# Altium schematic sheet 04 PMIC2.SchDoc
size 420 x 297 mm
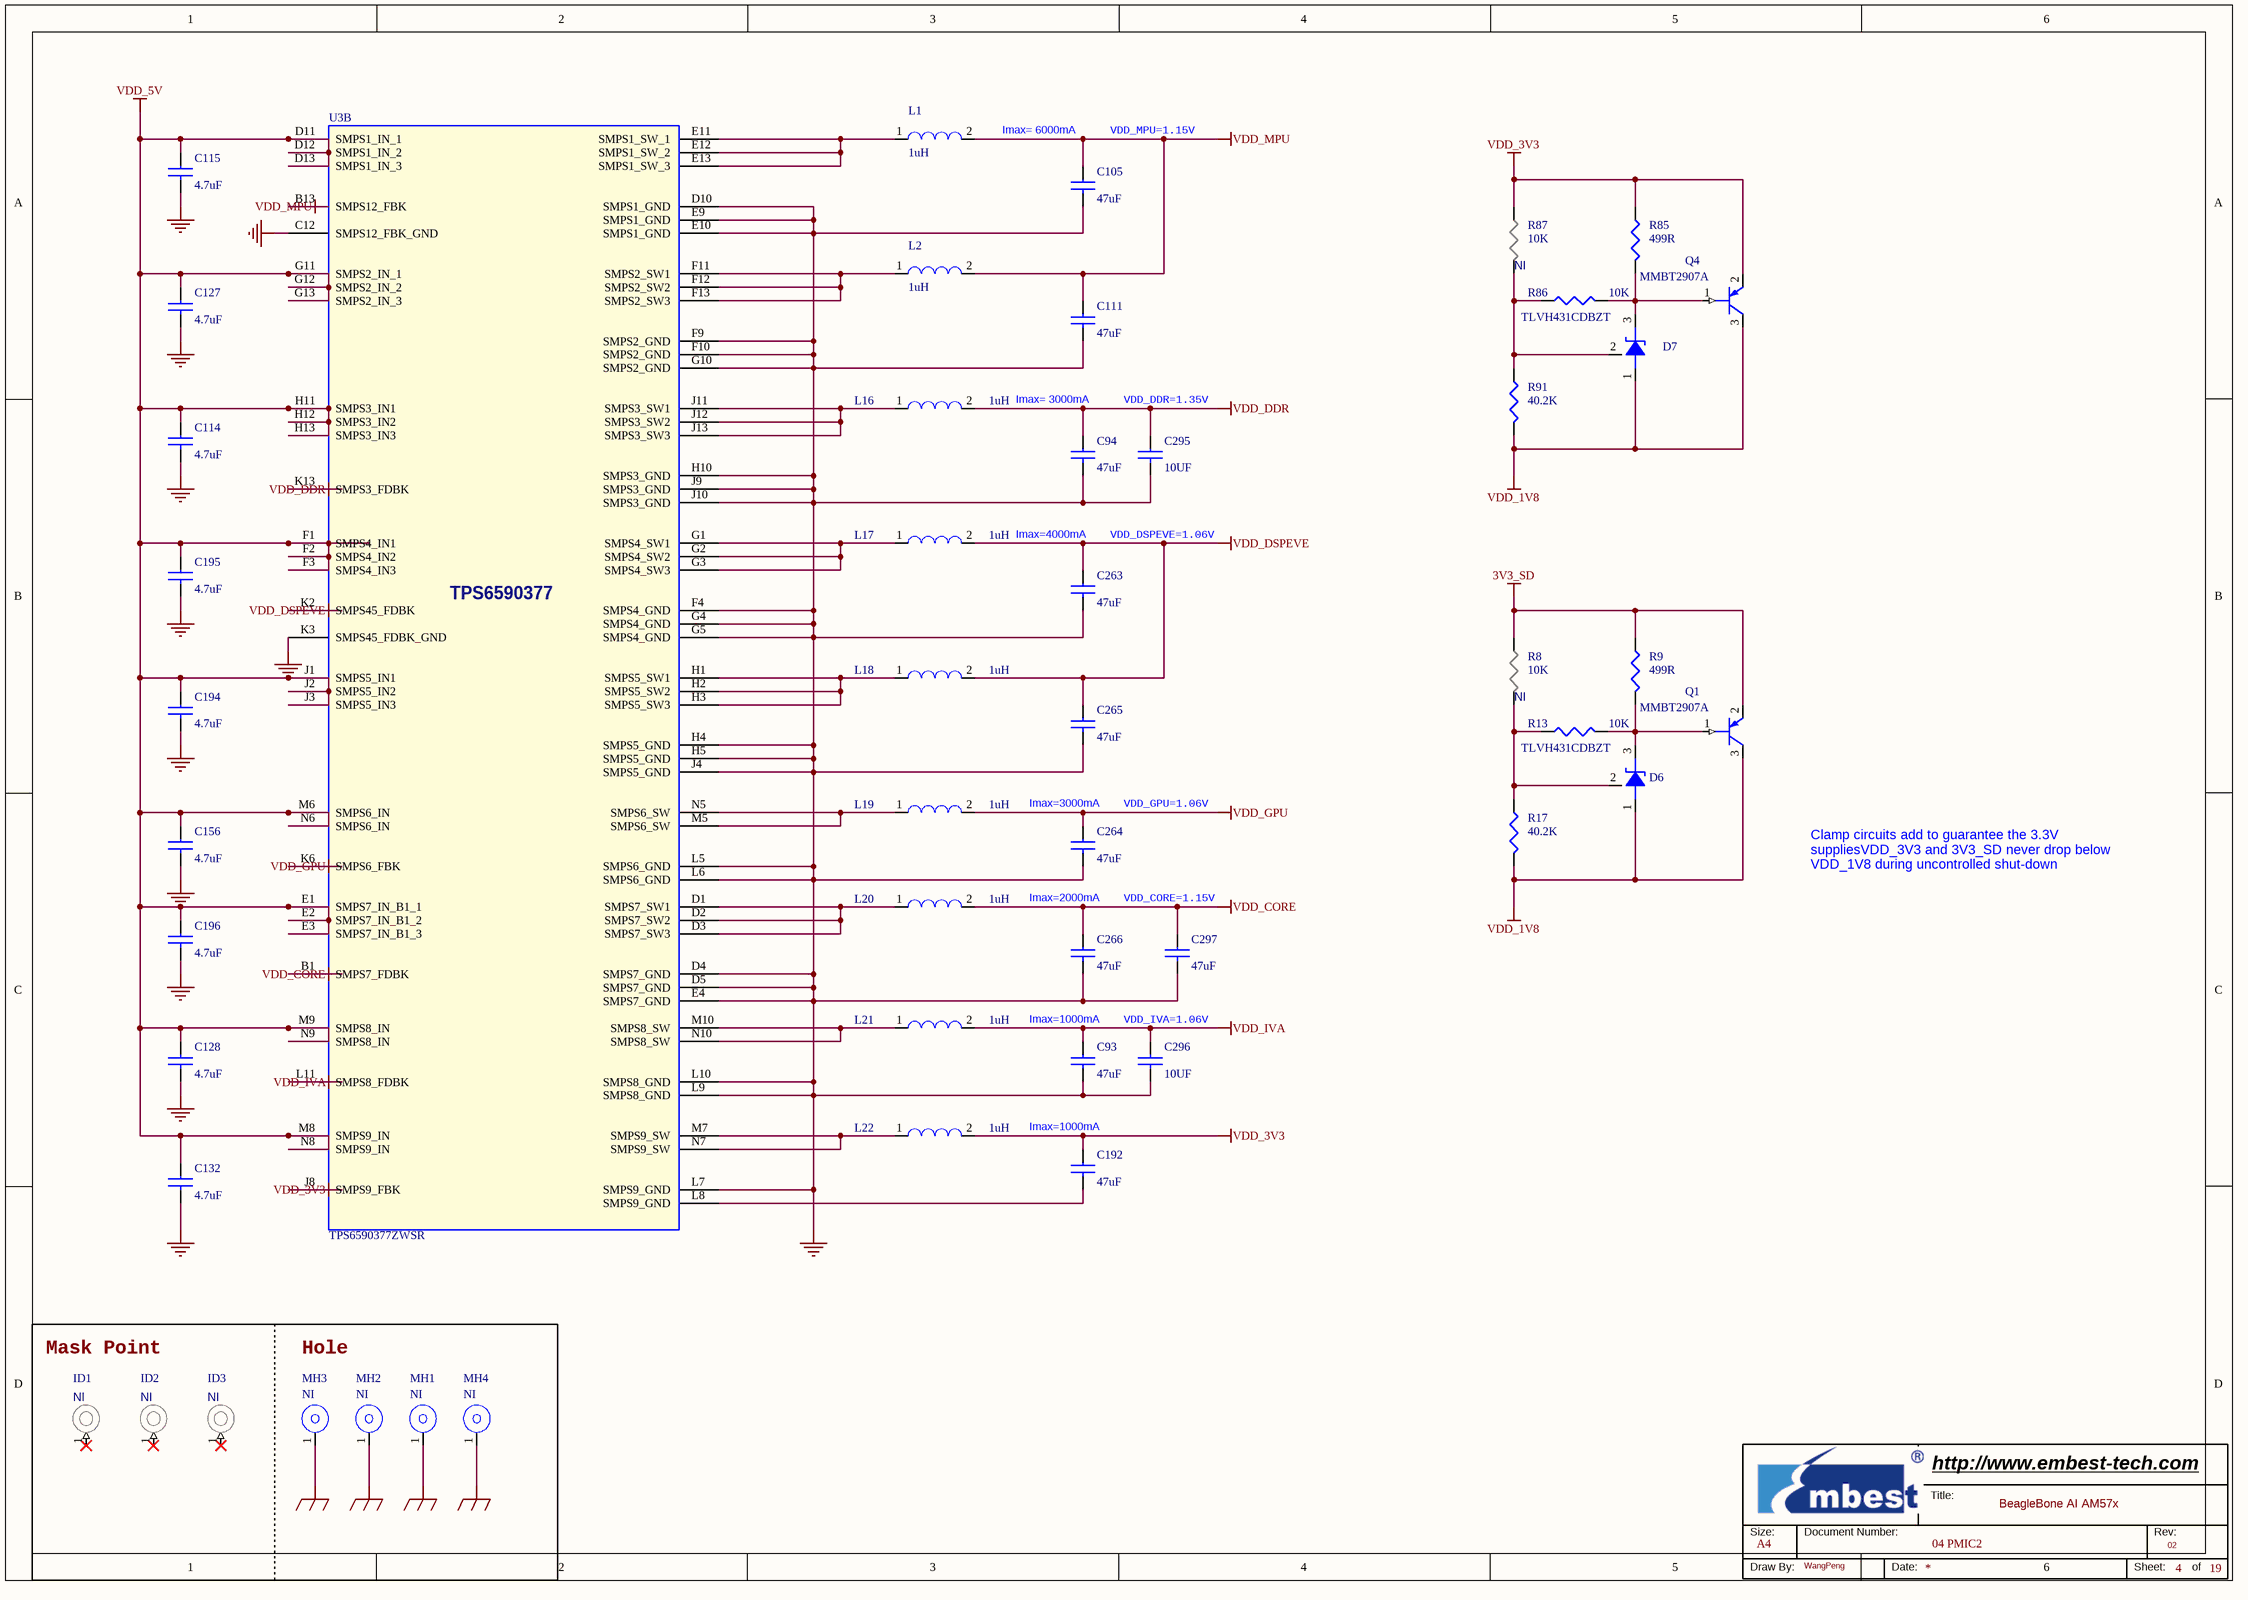
[diagram p0: 04 PMIC2.SchDoc]

## Parts
*  Page Count: 19  Page Number: 4  Page Size: A4  Title: BeagleBone AI AM57x  RevCode: 02  Doc: 04 PMIC2  Drawing: WangPeng  (hidden comment: Embest Title)  (graphical)
C93  47uF  [C0805]
C94  47uF  [C0805]
C105  47uF  [C0805]
C111  47uF  [C0805]
C114  4.7uF  [C0603]
C115  4.7uF  [C0603]
C127  4.7uF  [C0603]
C128  4.7uF  [C0603]
C132  4.7uF  [C0603]
C156  4.7uF  [C0603]
C192  47uF  [C0805]
C194  4.7uF  [C0603]
C195  4.7uF  [C0603]
C196  4.7uF  [C0603]
C263  47uF  [C0805]
C264  47uF  [C0805]
C265  47uF  [C0805]
C266  47uF  [C0805]
C295  10UF  [C0603]
C296  10UF  [C0402]
C297  47uF  [C0805]
D6  TLVH431CDBZT  [sot95p240x120-3n]
D7  TLVH431CDBZT  [sot95p240x120-3n]
ID1  NI  [FD40]
ID2  NI  [FD40]
ID3  NI  [FD40]
L1  1uH  [L40X40_B]
L2  1uH  [L40X40_B]
L16  1uH  [INDPW250X200X105N]
L17  1uH  [INDPW250X200X105N]
L18  1uH  [INDPW250X200X105N]
L19  1uH  [INDPW250X200X105N]
L20  1uH  [INDPW250X200X105N]
L21  1uH  [INDPW250X200X105N]
L22  1uH  [INDPW250X200X105N]
MH1  NI  [MTGH200C125D_PL]
MH2  NI  [MTGH200C125D_PL]
MH3  NI  [MTGH200C125D_PL]
MH4  NI  [MTGH200C125D_PL]
Q1  MMBT2907A  [SOT23_123]
Q4  MMBT2907A  [SOT23_123]
R8  10K  ASSY: NI  [R0402]
R9  499R  [R0402]
R13  10K  [R0402]
R17  40.2K  [R0402]
R85  499R  [R0402]
R86  10K  [R0402]
R87  10K  ASSY: NI  [R0402]
R91  40.2K  [R0402]
U3  TPS6590377ZWSR  [bga12x12-169-55m]  (part B of 2)

## Nets
3V3_SD: Q1.2(E) R8.1 R9.1
GND: C93.2 C94.2 C105.2 C111.2 C114.2 C115.2 C127.2 C128.2 C132.2 C156.2 C194.2 C195.2 C196.2 C263.2 C264.2 C265.2 C266.2 C295.2 C296.2 C297.2 U3.C12(SMPS12_FBK_GND) U3.D4(SMPS7_GND) U3.D5(SMPS7_GND) U3.D10(SMPS1_GND) U3.E4(SMPS7_GND) U3.E9(SMPS1_GND) U3.E10(SMPS1_GND) U3.F4(SMPS4_GND) U3.F9(SMPS2_GND) U3.F10(SMPS2_GND) U3.G4(SMPS4_GND) U3.G5(SMPS4_GND) U3.G10(SMPS2_GND) U3.H4(SMPS5_GND) U3.H5(SMPS5_GND) U3.H10(SMPS3_GND) U3.J4(SMPS5_GND) U3.J9(SMPS3_GND) U3.J10(SMPS3_GND) U3.K3(SMPS45_FDBK_GND) U3.L5(SMPS6_GND) U3.L6(SMPS6_GND) U3.L7(SMPS9_GND) U3.L9(SMPS8_GND) U3.L10(SMPS8_GND)
GND_EARTH: MH1.1 MH2.1 MH3.1 MH4.1
VDD_1V8: D6.1(A) D7.1(A) Q1.3(C) Q4.3(C) R17.2 R91.2
VDD_3V3: C192.1 L22.2 Q4.2(E) R85.1 R87.1 U3.J8(SMPS9_FBK)
VDD_5V: C114.1 C115.1 C127.1 C128.1 C132.1 C156.1 C194.1 C195.1 C196.1 U3.D11(SMPS1_IN_1) U3.D12(SMPS1_IN_2) U3.D13(SMPS1_IN_3) U3.E1(SMPS7_IN_B1_1) U3.E2(SMPS7_IN_B1_2) U3.E3(SMPS7_IN_B1_3) U3.F1(SMPS4_IN1) U3.F2(SMPS4_IN2) U3.F3(SMPS4_IN3) U3.G11(SMPS2_IN_1) U3.G12(SMPS2_IN_2) U3.G13(SMPS2_IN_3) U3.H11(SMPS3_IN1) U3.H12(SMPS3_IN2) U3.H13(SMPS3_IN3) U3.J1(SMPS5_IN1) U3.J2(SMPS5_IN2) U3.J3(SMPS5_IN3) U3.M6(SMPS6_IN) U3.M8(SMPS9_IN) U3.M9(SMPS8_IN) U3.N6(SMPS6_IN) U3.N8(SMPS9_IN) U3.N9(SMPS8_IN)
VDD_CORE: C266.1 C297.1 L20.2 U3.B1(SMPS7_FDBK)
VDD_DDR: C94.1 C295.1 L16.2 U3.K13(SMPS3_FDBK)
VDD_DSPEVE: C263.1 C265.1 L17.2 L18.2 U3.K2(SMPS45_FDBK)
VDD_GPU: C264.1 L19.2 U3.K6(SMPS6_FBK)
VDD_IVA: C93.1 C296.1 L21.2 U3.L11(SMPS8_FDBK)
VDD_MPU: C105.1 C111.1 L1.2 L2.2 U3.B13(SMPS12_FBK)
NetC192_2: C192.2 U3.L8(SMPS9_GND)
NetD6_2: D6.2(NC) R8.2 R13.1 R17.1
NetD6_3: D6.3(K) Q1.1(B) R9.2 R13.2
NetD7_2: D7.2(NC) R86.1 R87.2 R91.1
NetD7_3: D7.3(K) Q4.1(B) R85.2 R86.2
NetL1_1: L1.1 U3.E11(SMPS1_SW_1) U3.E12(SMPS1_SW_2) U3.E13(SMPS1_SW_3)
NetL2_1: L2.1 U3.F11(SMPS2_SW1) U3.F12(SMPS2_SW2) U3.F13(SMPS2_SW3)
NetL16_1: L16.1 U3.J11(SMPS3_SW1) U3.J12(SMPS3_SW2) U3.J13(SMPS3_SW3)
NetL17_1: L17.1 U3.G1(SMPS4_SW1) U3.G2(SMPS4_SW2) U3.G3(SMPS4_SW3)
NetL18_1: L18.1 U3.H1(SMPS5_SW1) U3.H2(SMPS5_SW2) U3.H3(SMPS5_SW3)
NetL19_1: L19.1 U3.M5(SMPS6_SW) U3.N5(SMPS6_SW)
NetL20_1: L20.1 U3.D1(SMPS7_SW1) U3.D2(SMPS7_SW2) U3.D3(SMPS7_SW3)
NetL21_1: L21.1 U3.M10(SMPS8_SW) U3.N10(SMPS8_SW)
NetL22_1: L22.1 U3.M7(SMPS9_SW) U3.N7(SMPS9_SW)

Not connected (* = marked no-connect by the designer): ID1 1*; ID2 1*; ID3 1*

## Notes on the sheet
- Imax= 6000mA
- (near C105) VDD_MPU=1.15V
- Imax= 3000mA
- VDD_DDR=1.35V
- Imax=4000mA
- VDD_DSPEVE=1.06V
- (near C264) Imax=3000mA
- (near C264) VDD_GPU=1.06V
- Clamp circuits add to guarantee the 3.3V
  suppliesVDD_3V3 and 3V3_SD never drop below
  VDD_1V8 during uncontrolled shut-down
- Imax=2000mA
- VDD_CORE=1.15V
- (near C93) Imax=1000mA
- (near C296) VDD_IVA=1.06V
- (near C192) Imax=1000mA
- Mask Point
- Hole
- (in symbol Embest Title) Title:; Size:; Document Number:; Rev:; Draw By:; Date:; Sheet:; of
- (in symbol TPS659037, part B) TPS6590377

## Library data of the parts
C93 C94 C105 C111 C192 C263-C266 C297 = C: CAP,47UF,+/-20%,X5R,6.3V,SMD0805; Manufacturer Part Number: GRM21BR60J476ME15L; Manufacturer: MURATA; Embest PN: 1004001100164; Part Type: Ceramic Capacitor
C114 = C: CAP,4.7UF,+/-10%,X5R,16V,SMD0603; Manufacturer Part Number: GRM188R61C475KAAJD; Manufacturer: Murata; Embest PN: 1004001100127; SIGNAL_MODEL: CAP_0.1UF_X7R_16V_10%_0402__402_0.1uf_16V; Datasheet: Y:\ÐÂK3ÏµÍ³ÎïÁÏdatasheet\[1003_1004]capacitor-resistor µçÈÝ¡¢µç×è\1004001100127 GRM188R61C475KAAJD murata.pdf; Part Type: Ceramic Capacitor
C115 C132 = C: CAP,4.7UF,+/-10%,X5R,16V,SMD0603; Manufacturer Part Number: GRM188R61C475KAAJD; Manufacturer: Murata; Embest PN: 1004001100127; Datasheet: Y:\ÐÂK3ÏµÍ³ÎïÁÏdatasheet\[1003_1004]capacitor-resistor µçÈÝ¡¢µç×è\1004001100127 GRM188R61C475KAAJD murata.pdf; Part Type: Ceramic Capacitor
C127 C128 C156 C194-C196 = C: CAP,4.7UF,+/-10%,X5R,16V,SMD0603; Manufacturer: Murata; Manufacturer Part Number: GRM188R61C475KAAJD; Embest PN: 1004001100127; Part Type: Ceramic Capacitor; Datasheet: Y:\ÐÂK3ÏµÍ³ÎïÁÏdatasheet\[1003_1004]capacitor-resistor µçÈÝ¡¢µç×è\1004001100127 GRM188R61C475KAAJD murata.pdf
C295 = C: CAP,10UF,+/-10%,X5R,10V,SMD0603; Manufacturer: Murata; Manufacturer Part Number: GRM188R61A106KE69D; Embest PN: 1004001100129; Part Type: Ceramic Capacitor; Datasheet: Y:\ÐÂK3ÏµÍ³ÎïÁÏdatasheet\[1003_1004]capacitor-resistor µçÈÝ¡¢µç×è\1004001100129T2 C1608X5R1A106M.pdf
C296 = C: CAP,10UF,+/-20%,X5R,6.3V,SMD0402; Manufacturer Part Number: CC0402MRX5R5BB106; Manufacturer: Yageo; Rating: <Rating>; Embest PN: 1004001100345; PCB Footprint: C0402; Part Type: Ceramic Capacitor
D6 D7 = DIODE ZENER_3: IC,Low-Voltage Adjustable Precision Shunt Regulators; Manufacturer: TI; Embest PN: 1002020100318; Status: AM5728; Manufacturer Part Number: TLVH431CDBZT; Part Type: Specific IC
ID1-ID3 = MARK POINT: MARK  point,DIA 40mil; Embest PN: PN002; ASSY: NI; Part Type: MARK
L1 = L: Power Inductor,Magnetic shielded,1uH,idc4.5A,27mohm,4.3x4.0x2.0mm,20%,SMD,TR; Manufacturer Part Number: SP04O203M1U; Manufacturer: GAUSSTEK; Embest PN: 1005004100077; Datasheet: Y:\ÐÂK3ÏµÍ³ÎïÁÏdatasheet\[1005]beads-inductors ´ÅÖé¡¢µç¸Ð\1005004100077 S-Ó¢ÝíÌØSP04O203M1U.pdf; Part Type: Power Inductor
L2 = L: Power Inductor,Magnetic shielded,1uH,idc4.5A,27mohm,4.3x4.0x2.0mm,20%,SMD,TR; Manufacturer: GAUSSTEK; Manufacturer Part Number: SP04O203M1U; Embest PN: 1005004100077; Part Type: Power Inductor; Datasheet: Y:\ÐÂK3ÏµÍ³ÎïÁÏdatasheet\[1005]beads-inductors ´ÅÖé¡¢µç¸Ð\1005004100077 S-Ó¢ÝíÌØSP04O203M1U.pdf
L16 L18 L20 L22 = L: SMD Power Inductors 1uH +/-20%;-25 ¡ãC to +125 ¡ãC SATURATION CURRENT 3.1A;DCR 85m¦¸£¬Size:2.5*2.0*1.05mm; Manufacturer: Gausstek; Manufacturer Part Number: DI20A102M1U; Embest PN: 1005001100194; Part Type: Inductor; Status: Hamster AM572x; Datasheet: Y:\ÐÂK3ÏµÍ³ÎïÁÏdatasheet\[1005]beads-inductors ´ÅÖé¡¢µç¸Ð\1005001100194 DI20A102M1U.pdf
L17 L19 L21 = L: SMD Power Inductors 1uH +/-20%;-25 ¡ãC to +125 ¡ãC SATURATION CURRENT 3.1A;DCR 85m¦¸£¬Size:2.5*2.0*1.05mm; Manufacturer Part Number: DI20A102M1U; Manufacturer: Gausstek; Embest PN: 1005001100194; Datasheet: Y:\ÐÂK3ÏµÍ³ÎïÁÏdatasheet\[1005]beads-inductors ´ÅÖé¡¢µç¸Ð\1005001100194 DI20A102M1U.pdf; Status: Hamster AM572x; Part Type: Inductor
MH1-MH4 = METALLIC HOLE: Plated hole,Circle,DAI 4.445MM ,VIA 3.175MM; Embest PN: PN094; Part Type: HOLE; Status: BeagleBone AI
Q1 Q4 = PNP: Transistor,PNP,MMBT2907A-7-F,60V,600MA,SOT-23,SMD; Manufacturer: Diodes; Embest PN: 1006012100001; Part Type: Transistor; Manufacturer Part Number: MMBT2907A-7-F; Datasheet: Y:\ÐÂK3ÏµÍ³ÎïÁÏdatasheet\[1006002~013]diodes-transistors ¶þÈý¼«¹Ü\1006012100001 Diodes MMBT2907A-7-F.pdf
R8 R13 R86 R87 = R: RES,10K,+/-1%,1/16W,SMD0402; Manufacturer Part Number: RC0402FR-0710KL; Manufacturer: YAGEO; Embest PN: 1003001100071; Part Type: Thick film Resistor
R9 R85 = R: RES,499R,+/-1%,1/16W,SMD0402; Manufacturer: YAGEO; Manufacturer Part Number: RC0402FR-07499RL; Embest PN: 1003001100576; Part Type: Thick film Resistor
R17 R91 = R: RES,40K2,+/-1%,1/16W,SMD0402; Manufacturer: YAGEO; Manufacturer Part Number: RC0402FR-0740K2L; Embest PN: 1003001100099; Part Type: Thick film Resistor
U3 = TPS659037: IC TPS659037 Power Management Unit (PMU) for Processor NFBGA-169 SMD; Manufacturer: TI; Embest PN: 1002004100230; Part Type: Power Management; Manufacturer Part Number: TPS6590377ZWSR; Status: AM5728; Datasheet: Y:\ÐÂK3ÏµÍ³ÎïÁÏdatasheet\[1002]IC ¼¯³ÉµçÂ·\1002004100230 [TPS6590377ZWSR] tps659037.pdf
* = Embest Title: Page Create Date: May 29, 2006; WebSite: http://www.embest-tech.com; Company: Embest; Page Modify Date: *